# EAGLE design commadorable64-touch-v1-43 (EAGLE 6.5.0)
CNAME: An adorable Commodore 64; CREVISION: 1; DESIGNER: Johan Kanflo
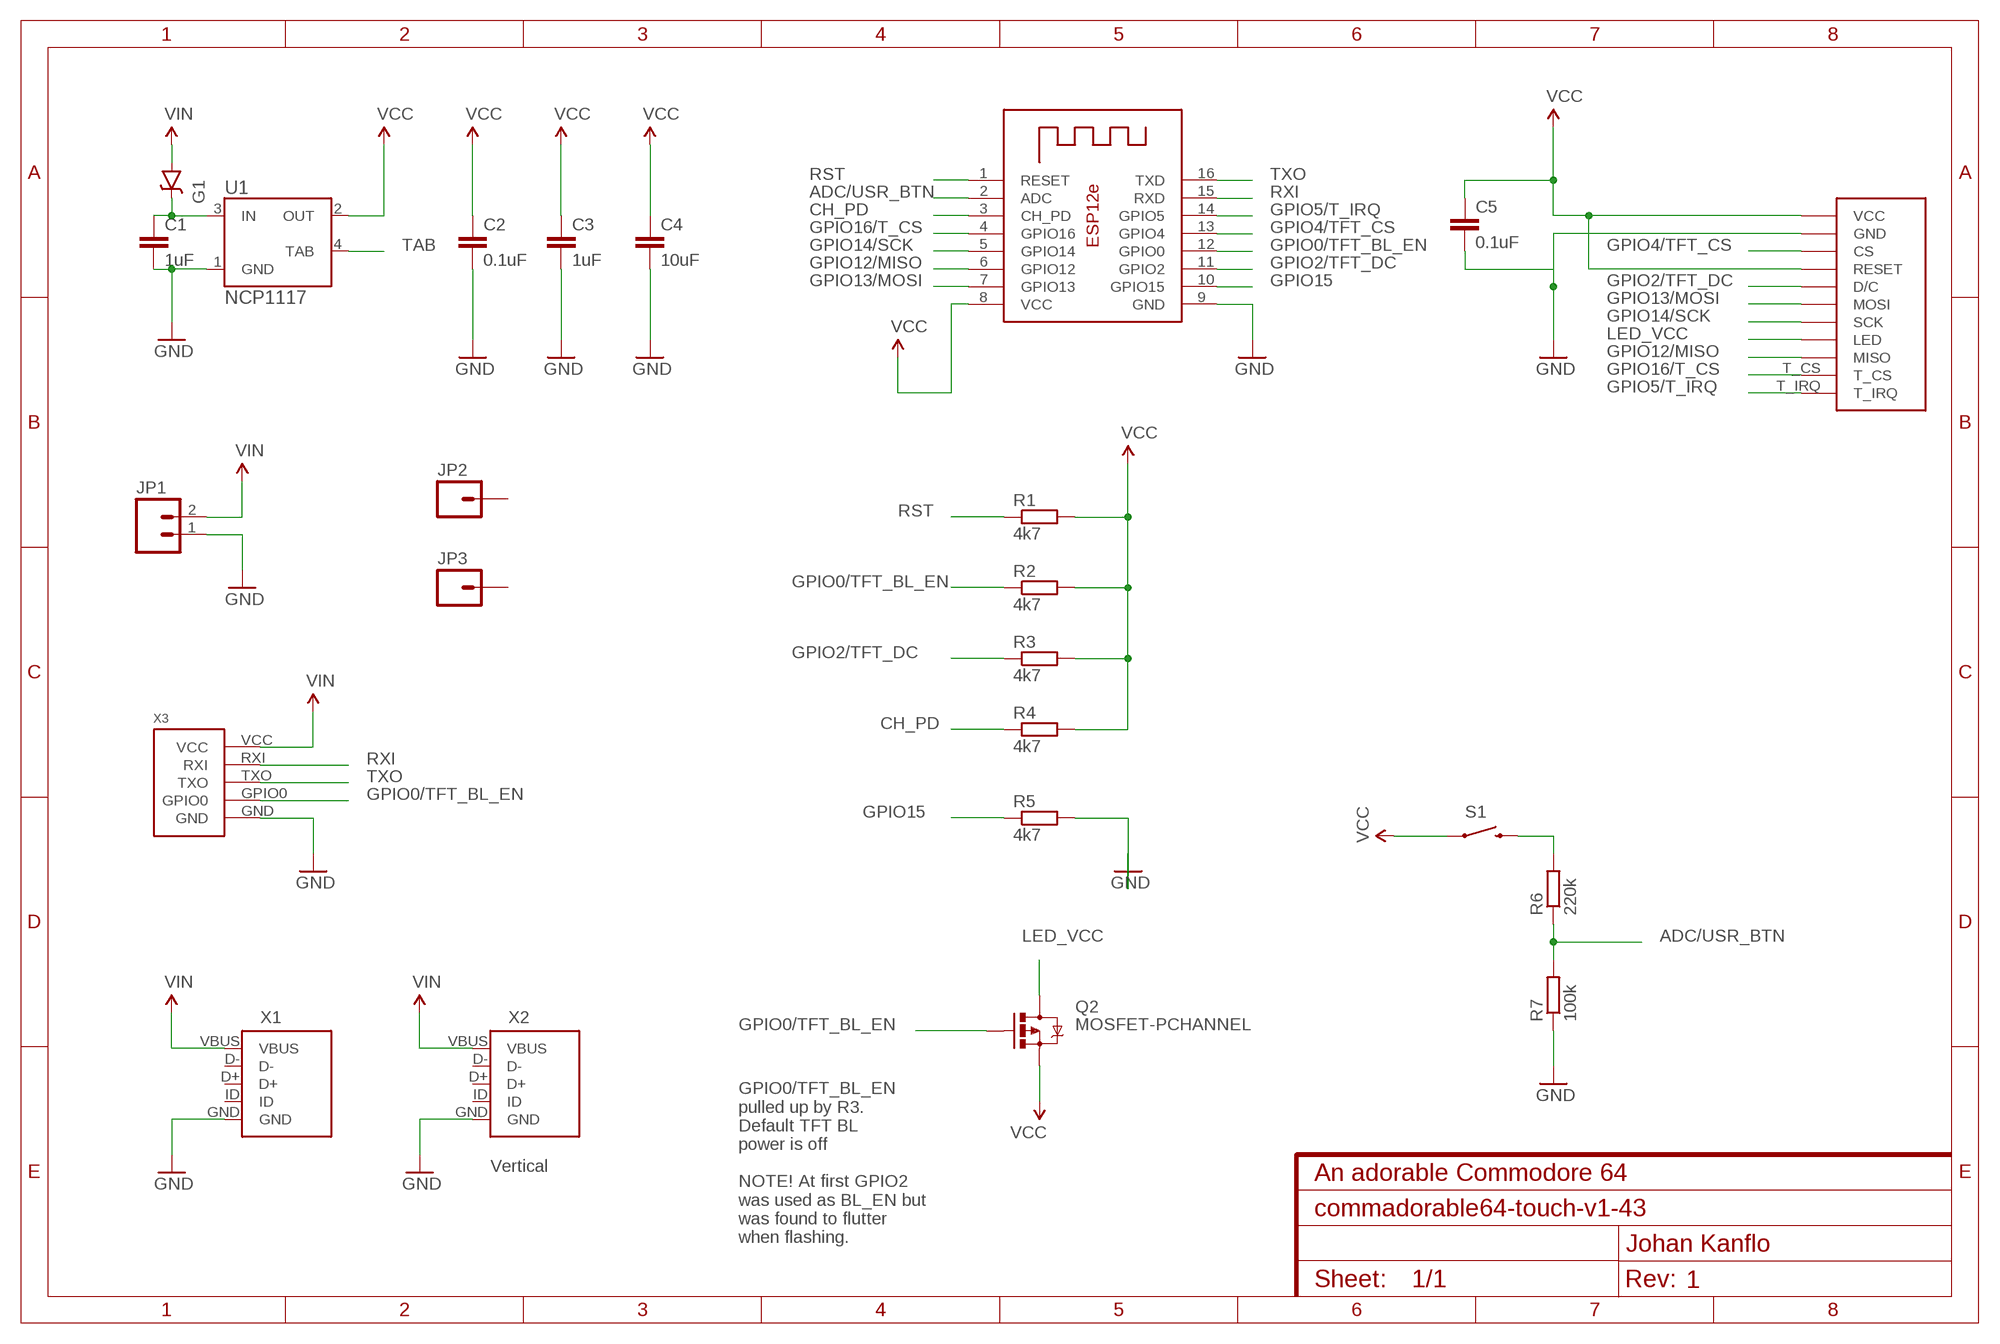
[diagram p0: schematic, sheet 1]

## Parts
C1  1uF  CAP0603-CAP  [0603-CAP]
C2  0.1uF  CAP0603-CAP  [0603-CAP]
C3  1uF  CAP0603-CAP  [0603-CAP]
C4  10uF  CAP0603-CAP  [0603-CAP]
C5  0.1uF  CAP0603-CAP  [0603-CAP]
G1  DIODE-SCHOTTKYSOD-123FL  [SOD-123FL]
J1  SPI_TFT_DISPLAY_TOUCH  [SPI_DISPLAY_TOUCH]
JP1  M02PTH  [1X02]
JP2  M01PTH  [1X01]
JP3  M01PTH  [1X01]
Q2  MOSFET-PCHANNEL  [SOT23-3]
R1  4k7  R-EU_R0603  [R0603]
R2  4k7  R-EU_R0603  [R0603]
R3  4k7  R-EU_R0603  [R0603]
R4  4k7  R-EU_R0603  [R0603]
R5  4k7  R-EU_R0603  [R0603]
R6  220k  R-EU_R0603  [R0603]
R7  100k  R-EU_R0603  [R0603]
S1  SWITCH-MOMENTARY-2SMD-1101NE  [TACTILE-SWITCH-1101NE]
U1  NCP1117  [SOT223]
U2  ESP-12E  [ESP-12E]
X1  MICRO_USB_TH  [MICRO_USB_TH]
X2  MICRO_USB_TH_VERTICAL  [MICRO_USB_TH_VERTICAL]
X3  ESPROGESPROG-DEVICE  [ESPROG]

## Nets
ADC/USR_BTN: R6.1 R7.2 U2.2(ADC)
CH_PD: R4.1 U2.3(CH_PD)
GND: C1.2 C2.2 C3.2 C4.2 C5.2 J1.GND JP1.1 R5.2 R7.1 U1.1(GND) U2.9(GND) X1.GND X2.GND X3.GND
GPIO0/TFT_BL_EN: Q2.1(G) R2.1 U2.12(GPIO0) X3.GPIO0
GPIO2/TFT_DC: J1.D/C R3.1 U2.11(GPIO2)
GPIO4/TFT_CS: J1.CS U2.13(GPIO4)
GPIO5/T_IRQ: J1.T_IRQ U2.14(GPIO5)
GPIO12/MISO: J1.MISO J1.T_MISO(MISO) U2.6(GPIO12)
GPIO13/MOSI: J1.MOSI J1.T_MOSI(MOSI) U2.7(GPIO13)
GPIO14/SCK: J1.SCK J1.T_SCK(SCK) U2.5(GPIO14)
GPIO15: R5.1 U2.10(GPIO15)
GPIO16/T_CS: J1.T_CS U2.4(GPIO16)
LED_VCC: J1.LED Q2.3(D)
N$1: C1.1 G1.C U1.3(IN)
N$4: R6.2 S1.2
RST: R1.1 U2.1(RESET)
RXI: U2.15(RXD) X3.RXI
TAB: U1.4(TAB)
TXO: U2.16(TXD) X3.TXO
VCC: C2.1 C3.1 C4.1 C5.1 J1.RESET J1.VCC Q2.2(S) R1.2 R2.2 R3.2 R4.2 S1.1 U1.2(OUT) U2.8(VCC)
VIN: G1.A JP1.2 X1.VBUS X2.VBUS X3.VCC
Unconnected: JP2.1 JP3.1 X1.D+ X1.D- X1.ID X2.D+ X2.D- X2.ID

## Notes on the sheet
- Vertical
- GPIO0/TFT_BL_EN
  pulled up by R3.
  Default TFT BL
  power is off
  
  NOTE! At first GPIO2
  was used as BL_EN but
  was found to flutter
  when flashing.

## Library data of the parts
C1-C5 = SparkFun-Capacitors:CAP: Capacitor Standard 0603 ceramic capacitor, and 0.1" leaded capacitor.
G1 = kanflo:DIODE-SCHOTTKY
J1 = kanflo:SPI_TFT_DISPLAY_TOUCH: SPI TFT Display with touch Connector for the cheap 2.4"/2.8" Serial SPI TFT displays with touch found on eBay.
JP1 = SparkFun-Connectors:M02: Standard 2-pin 0.1" header. Use with - straight break away headers ( PRT-00116) - right angle break away headers (PRT-00553) - swiss pins (PRT-00743) - machine pins (PRT-00117) - female headers (PRT-00115) Molex polarized connector foot print use with: PRT-08233 with associated crimp pins and housings. 2.54_SCREWTERM for use with PRT-10571. 3.5mm Screw Terminal footprints for PRT-08084 5mm Screw Terminal footprints for use with PRT-08432
JP2 JP3 = SparkFun-Connectors:M01: Header 1 Standard 1-pin 0.1" header. Use with straight break away headers (SKU : PRT-00116), right angle break away headers (PRT-00553), swiss pins (PRT-00743), machine pins (PRT-00117), and female headers (PRT-00115).
Q2 = SparkFun-DiscreteSemi:MOSFET-PCHANNEL: Generic PMOSFET IRLML2244 - TRANS-11153 (SOT-23 -20V -4.3A) (1.Gate 2.Source 3.Drain) FQP27P06 - COM-10349 <http://www.sparkfun.com/products/10349> (TO-220 -60V -27A) (1.Gate 2.Source 3.Drain); PROD_ID: TRANS-08285
R1-R7 = resistor:R-EU_: RESISTOR, European symbol
S1 = SparkFun-Electromechanical:SWITCH-MOMENTARY-2: Various NO switches- pushbuttons, reed, etc; PROD_ID: SWCH-00815
U1 = ELL-i-PowerIC:NCP1117
U2 = kanflo:ESP-12E: ESP12e module This is a copy of AdaFruit's device with correct pin order for GPIO4 and GPIO5.
X1 = kanflo:MICRO_USB_TH: Micro USB through hole connector A low cost micro USB connector from eBay, found here <http://www.ebay.com/itm/171309997171>.
X2 = kanflo:MICRO_USB_TH_VERTICAL: Vertical micro USB through hole connector A low cost vertical micro USB connector from eBay, found here <http://www.ebay.com/itm/181392933768>.
X3 = kanflo:ESPROG

## Board
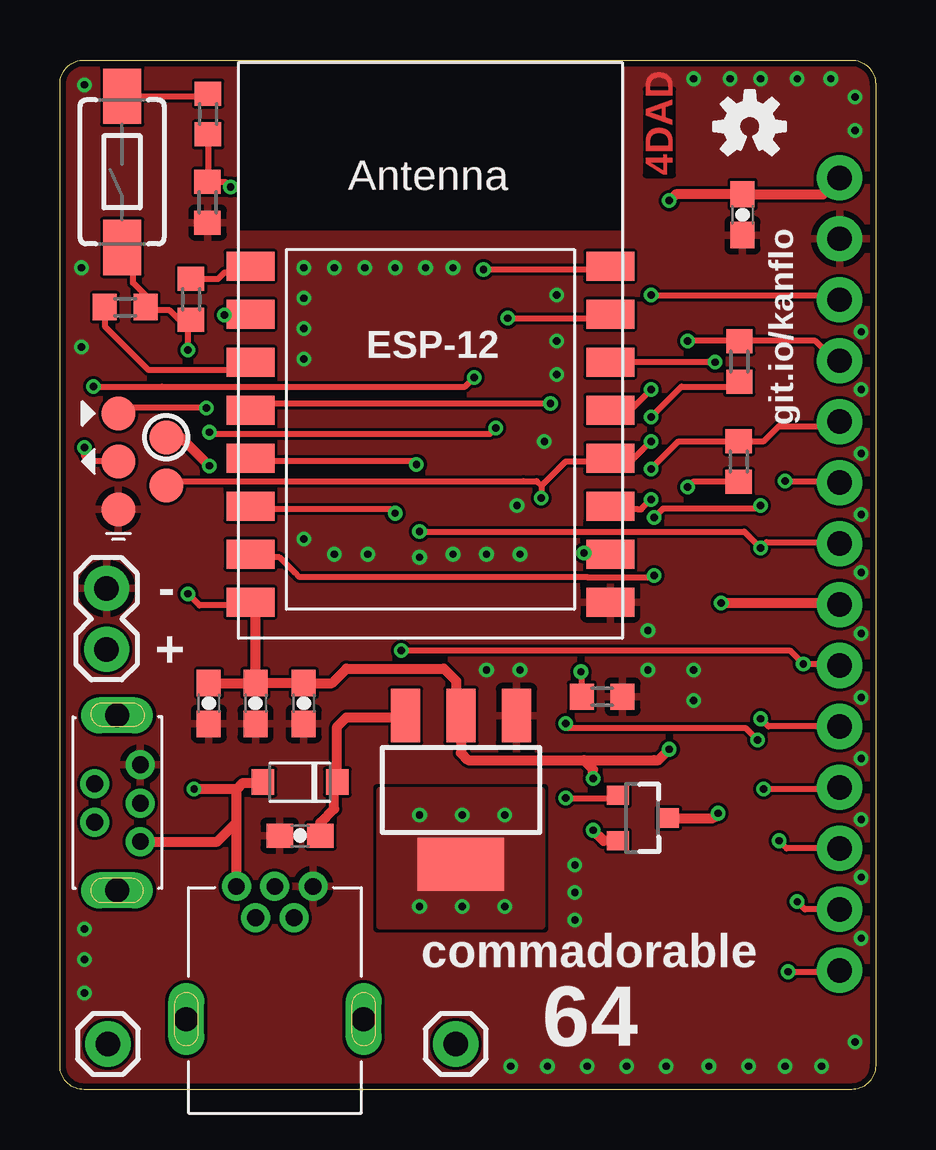
[diagram p1: board, top side]
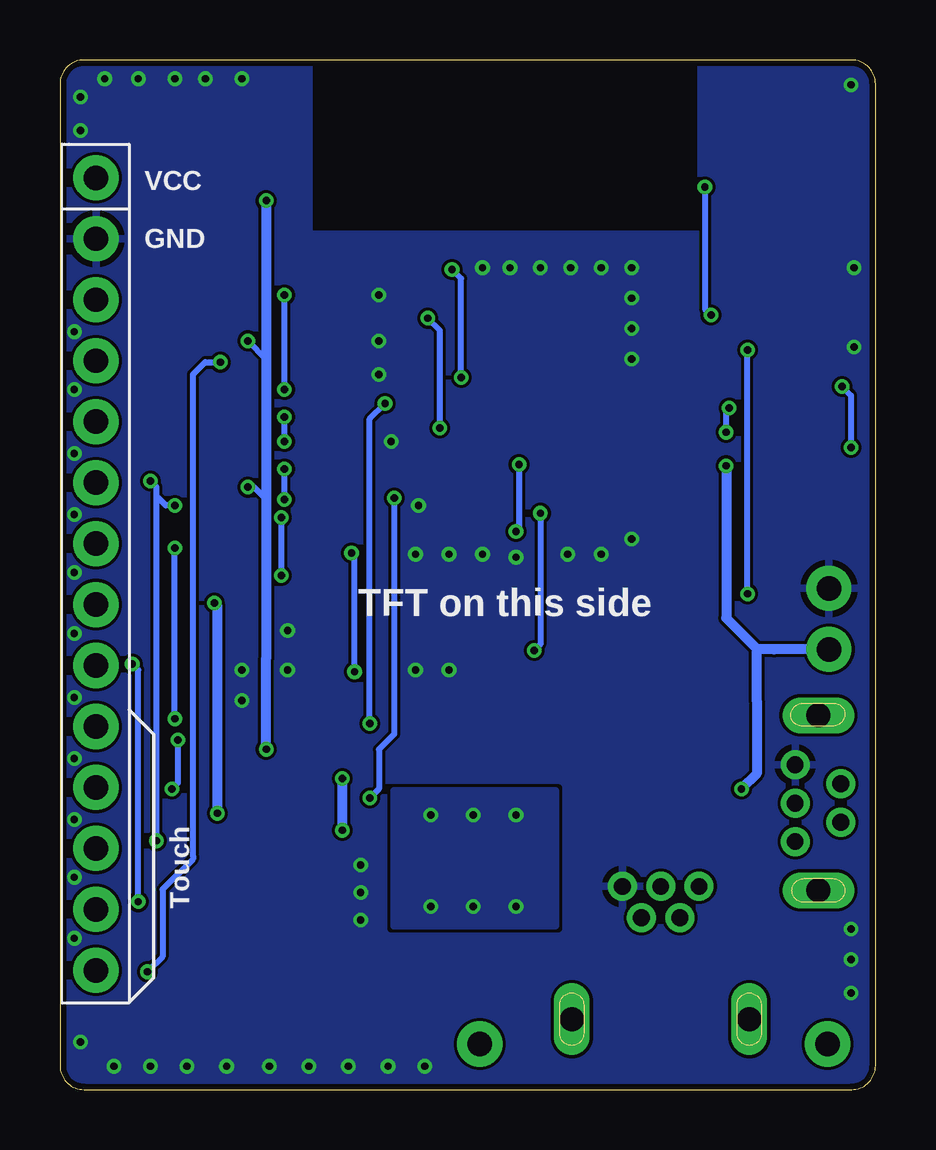
[diagram p2: board, bottom side, seen from below]

Size 34 x 42.9 mm. Coordinates in mm from the lower left corner, seen from the top.
Outline: 34,41.9 34,1 arc-90 33,0 1,0 arc-90 0,1 0,41.9 arc-90 1,42.9 33,42.9 arc-90 34,41.9
Copper layers (1*16): Top 0.035mm / dielectric 1.5mm / Bottom 0.035mm
Design rules "dirt_cheap_dirty_boards.v1": minimum track width 5mil, minimum drill 12mil, track to track 5mil, track to pad 5mil, pad to pad 5mil, via to via 5mil, smd to smd 0mil, copper to edge 10mil, drill to drill 10mil, minimum pad ring 10mil, minimum via ring 6mil, stop-mask expansion 2mil, vias tented up to drill 25mil, thermal gap 10mil

### Footprints (pad centres in the part's own frame; a part is rotated, then mirrored left to right if it is on the bottom)
0603-CAP = smd 1.1 x 1: 1 -0.85,0; 2 0.85,0
SOD-123FL = smd 0.95 x 1.05: A -1.6,0; C 1.5,0
SPI_DISPLAY_TOUCH = drill 1.016 pad 1.88: CS 0,7.62; D/C 0,2.54; GND 0,10.16; LED 0,-5.08; MISO 0,-7.62; MOSI 0,0; RESET 0,5.08; SCK 0,-2.54; T_CS 0,-12.7; T_IRQ 0,-20.32; T_MISO 0,-17.78; T_MOSI 0,-15.24; T_SCK 0,-10.16; VCC 0,12.7
1X02 = drill 1.016 pad 1.88: 1 0,0; 2 2.54,0
1X01 = drill 1.016 pad 1.88: 1 0,0
SOT23-3 = smd 0.8 x 0.9: 1 -0.95,-1; 2 0.95,-1; 3 0,1.1
R0603 = smd 1 x 1.1: 1 -0.85,0; 2 0.85,0
TACTILE-SWITCH-1101NE = smd 2.3 x 1.6: 1 -3.15,0; 2 3.15,0
SOT223 = smd 1.219 x 2.235: 1 -2.311,-3.099; 2 0,-3.099; 3 2.311,-3.099 | smd 3.6 x 2.2: 4 0,3.099
ESP-12E = smd 2 x 1.2: 1 -7.5,4.5; 2 -7.5,2.5; 3 -7.5,0.5; 4 -7.5,-1.5; 5 -7.5,-3.5; 6 -7.5,-5.5; 7 -7.5,-7.5; 8 -7.5,-9.5; 9 7.5,-9.5; 10 7.5,-7.5; 11 7.5,-5.5; 12 7.5,-3.5; 13 7.5,-1.5; 14 7.5,0.5; 15 7.5,2.5; 16 7.5,4.5
MICRO_USB_TH = drill 0.7: D+ -0.11,4.73; D- -0.91,3.43; GND 1.49,4.73; ID 0.69,3.43; VBUS -1.71,4.73 | drill 1 pad 1.5 long: P$1 -3.8,-0.8; P$2 3.6,-0.8
MICRO_USB_TH_VERTICAL = drill 0.7: D+ -0.16,-1.27; D- -0.96,0.63; GND 1.44,-1.27; ID 0.65,0.63; VBUS -1.76,-1.27 | drill 1 pad 1.5 long: P$1 -3.8,-0.3; P$2 3.5,-0.3
ESPROG = smd 1.422 x 1.422: GND -1,-2; GPIO0 1,-1; RXI -1,2; TXO -1,0; VCC 1,1

### Placement (x,y rotation side)
C1  10.01,10.58 180 top
C2  6.2,16.09 270 top
C3  8.16,16.09 270 top
C4  10.16,16.09 270 top
C5  28.45,36.46 270 top
G1  10.06,12.81 0 top
J1  32.5,25.29 0 bottom
JP1  1.94,20.88 270 top
JP2  2,1.9 0 top
JP3  16.5,1.9 0 top
Q2  24.26,11.31 270 top
R1  5.46,32.93 270 top
R2  28.32,30.33 90 top
R3  28.3,26.17 270 top
R4  2.72,32.6 0 top
R5  22.61,16.37 0 top
R6  6.17,40.65 90 top
R7  6.15,36.97 90 top
S1  2.59,38.24 90 top
U1  16.72,12.48 180 top
U2  15.45,29.81 0 top
U$1  [OSHW-LOGO-S]  28.76,40.13 0 top
X1  9.06,3.74 0 top
X2  2.08,12.1 90 top
X3  3.43,26.18 0 top

### Tracks (layer width: path | path; a pad name or v marks a point on that pad's centre or on a via)
ADC/USR_BTN  (via drill 0.3 pad 0.25)
  Top 0.254: R6.1 6.17,37.84 R7.2 6.9,37.82 v7.11,37.6 | v6.86,32.27 8.23,32.27 U2.2
  Bottom 0.254: v7.11,37.6 7.11,32.52 v6.86,32.27
CH_PD
  Top 0.254: R4.1 1.87,31.8 3.68,29.98 8.13,29.98 U2.3
GND  (via drill 0.3 pad 0.25)
  other vias: 33.4,31.58 33.4,29.17 33.4,26.5 33.4,23.96 33.4,21.55 33.4,19.01 33.4,16.34 33.4,13.8 33.4,11.26 33.4,8.85 33.4,6.31 19.18,17.48 17.78,17.48 24.51,17.48 26.42,17.48 26.42,16.21 21.47,9.35 21.47,8.21 21.47,7.07 18.8,0.97 20.32,0.97 21.97,0.97 23.62,0.97 25.27,0.97 27.05,0.97 28.7,0.97 30.23,0.97 31.75,0.97 33.15,1.99 1.02,6.69 1.02,5.42 1.02,4.02 10.16,34.25 11.43,34.25 12.7,34.25 13.97,34.25 15.24,34.25 16.38,34.25 10.16,32.98 10.16,31.71 10.16,30.44 10.16,22.94 19.18,22.31 19.05,24.34 20.2,27.01 20.7,29.8 20.7,31.2 20.7,33.1 11.43,22.31 12.83,22.31 14.99,22.18 16.38,22.31 17.78,22.31 24.51,19.13 33.15,39.96 33.15,41.36 32.13,42.12 30.74,42.12 29.21,42.12 27.94,42.12 26.42,42.12 0.89,34.25 0.89,30.94 1.02,41.87
  pour Top (rank 6): 0,42.9 34,42.9 34,0 0,0
  pour Bottom (rank 6): 0,42.9 34,42.9 34,0 0,0
GPIO0/TFT_BL_EN  (via drill 0.3 pad 0.25)
  Top 0.254: 23.32,26.17 U2.12 | 28.13,29.68 R2.1 28.13,29.29 25.91,29.29 25.27,28.66 v24.64,28.02 | 20.07,25.16 21.08,26.17 23.32,26.17 | 23.32,26.17 U2.12 | 20.07,25.16 v20.07,24.65 | 23.2,12.2 Q2.1 23.14,12.15 v21.08,12.15 | U2.12 23.81,26.18 v24.64,27.01 | X3.GPIO0 4.78,25.18 4.95,25.36 19.31,25.36 19.87,25.36 20.07,25.16
  Bottom 0.254: v20.07,24.65 20.07,14.87 20.07,14.81 20.7,14.18 20.7,12.53 v21.08,12.15 | v24.64,27.01 v24.64,28.02
GPIO2/TFT_DC  (via drill 0.3 pad 0.25)
  Top 0.254: R3.1 29.35,27.02 29.97,27.64 32.31,27.64 J1.D/C | 28.29,27.01 R3.1 | U2.11 23.07,24.18 24.1,24.18 24.23,24.18 v24.64,24.59 | v24.64,25.86 25.78,27.01 28.29,27.01 | 28.29,27.01 R3.1
  Bottom 0.254: v24.64,24.59 v24.64,25.86
GPIO4/TFT_CS  (via drill 0.3 pad 0.25)
  Top 0.254: U2.13 23.65,28.18 v24.64,29.17 | v24.64,33.1 32.31,33.1 J1.CS
  Bottom 0.254: v24.64,29.17 v24.64,33.1
GPIO5/T_IRQ  (via drill 0.3 pad 0.25)
  Top 0.254: 23.38,30.24 U2.14 23.46,30.31 v27.31,30.31 | v30.35,4.91 32.44,4.91 J1.T_IRQ
  Bottom 0.254: v27.31,30.31 27.94,30.31 28.45,29.8 28.45,29.67 28.45,9.74 28.45,9.61 29.72,8.34 29.72,5.54 v30.35,4.91
GPIO12/MISO  (via drill 0.3 pad 0.25)
  Top 0.254: J1.T_MISO 31.06,7.51 v30.74,7.83 | J1.MISO 32.43,17.74 v30.99,17.74 30.43,18.3 26.23,18.3 v14.23,18.3 | v13.97,24.01 13.81,24.18 8.07,24.18 U2.6
  Bottom 0.254: v30.74,7.83 30.74,17.48 v30.99,17.74 | v13.97,24.01 13.97,18.55 v14.23,18.3
GPIO13/MOSI  (via drill 0.3 pad 0.25)
  Top 0.254: J1.T_MOSI 30.29,10.05 v29.97,10.37 | v30.23,25.36 32.43,25.36 J1.MOSI | v24.77,21.42 24.7,21.35 24.64,21.35 21.97,21.35 9.98,21.35 9.78,21.55 9.15,22.18 8.07,22.18 U2.7 | v24.77,23.83 25.15,24.21 29.09,24.21 v29.21,24.34
  Bottom 0.254: v29.97,10.37 29.97,24.72 | 29.97,24.72 29.97,25.1 v30.23,25.36 | v29.21,24.34 29.59,24.34 29.97,24.72 | v24.77,21.42 v24.77,23.83
GPIO14/SCK  (via drill 0.3 pad 0.25)
  Top 0.254: J1.T_SCK 29.53,15.13 v29.21,15.45 | v29.21,22.56 29.47,22.82 32.43,22.82 J1.SCK | v14.86,26.05 14.73,26.18 8.07,26.18 U2.5 | 29.09,22.69 v29.21,22.56 | v29.21,22.56 28.65,23.13 28.52,23.25 v14.99,23.25
  Bottom 0.254: v29.21,15.45 v29.21,22.56 | v14.86,26.05 14.86,23.38 v14.99,23.25
GPIO15  (via drill 0.3 pad 0.25)
  Top 0.254: R5.1 21.76,17.37 v21.72,17.41 | v21.85,22.36 23.14,22.36 U2.10
  Bottom 0.254: v21.72,17.41 21.72,22.24 v21.85,22.36
GPIO16/T_CS  (via drill 0.3 pad 0.25)
  Top 0.254: v20.45,28.59 8.73,28.59 U2.4 | v21.08,15.25 21.08,15.2 21.21,15.07 28.58,15.07 v29.09,14.56 | v29.34,12.53 32.44,12.53 J1.T_CS
  Bottom 0.254: v21.08,15.25 21.08,27.95 v20.45,28.59 | v29.09,14.56 29.09,12.78 v29.34,12.53
LED_VCC  (via drill 0.3 pad 0.25)
  Top 0.406: v27.56,20.28 32.43,20.28 J1.LED | Q2.3 27.24,11.31 v27.43,11.51
  Bottom 0.406: v27.56,20.28 27.43,20.15 27.43,15.07 v27.43,11.51
N$1
  Top 0.406: U1.3 14.33,15.51 11.94,15.51 11.56,15.13 G1.C 11.43,12.69 11.43,11.7 10.86,11.12 C1.1
N$4
  Top 0.254: S1.2 6.06,41.39 R6.2
RST
  Top 0.254: R1.1 6.59,33.78 6.86,34.05 8.2,34.05 U2.1
RXI  (via drill 0.3 pad 0.25)
  Top 0.254: v18.16,27.57 17.91,27.32 6.48,27.32 6.3,27.32 v6.23,27.39 | v18.67,32.14 23.29,32.14 U2.15 | v6.1,28.4 2.66,28.4 X3.RXI
  Bottom 0.254: v18.16,27.57 18.16,31.63 v18.67,32.14 | v6.23,27.39 6.23,28.28 v6.1,28.4
TAB  (via drill 0.3 pad 0.25)
  other vias: 14.99,7.63 16.77,7.63 18.54,7.63 14.99,11.44 16.77,11.44 18.54,11.44
  pour Top (no thermals): 13.34,12.46 20.07,12.46 20.07,6.82 13.34,6.82
  pour Bottom: 13.34,12.46 20.07,12.46 20.07,6.82 13.34,6.82
TXO  (via drill 0.3 pad 0.25)
  Top 0.254: v17.66,34.17 23.32,34.17 U2.16 | X3.TXO 1.21,26.18 1.02,26.37 v1.02,26.75 | v1.4,29.29 4.25,29.29 16.89,29.29 v17.27,29.67
  Bottom 0.254: v17.66,34.17 17.27,33.79 v17.27,29.67 | v1.02,26.75 1.02,28.91 v1.4,29.29
VCC  (via drill 0.3 pad 0.25)
  Top 0.254: J1.RESET 32.33,30.37 31.5,31.2 28.34,31.2 | 28.34,31.2 R2.2 | 28.34,31.2 26.42,31.2 v26.16,31.2 | R3.2 26.38,25.32 v26.16,25.1 | 7.82,20.18 5.81,20.18 v5.34,20.66 | v5.34,30.82 5.34,31.95 | 5.34,31.95 R1.2 | 5.34,31.95 5.09,31.95 4.57,32.47 3.7,32.47 R4.2 3.57,33.09 3.05,33.61 3.05,34.5 3.05,34.63 S1.1
  Top 0.406: C3.1 8.16,20.01 U2.8 7.82,20.18 | C3.1 C4.1 11.34,16.94 11.94,17.54 16,17.54 16.51,17.03 16.51,15.79 U1.2 16.72,14.03 17.02,13.73 21.85,13.73 | C2.1 C3.1 | 21.85,13.73 24.77,13.73 24.95,13.73 v25.4,14.18 | 5.34,31.95 R1.2 | J1.VCC 31.82,37.31 C5.1 25.67,37.31 v25.4,37.04 | Q2.2 22.67,10.37 v22.23,10.81 | v22.23,12.97 22.23,13.35 21.85,13.73
  Bottom 0.254: v26.16,31.2 25.4,30.44 | v26.16,25.1 25.91,25.1 25.4,24.59 | v5.34,20.66 v5.34,30.82
  Bottom 0.406: v25.4,37.04 25.4,30.44 25.4,24.59 25.4,17.99 v25.4,14.18 | v22.23,10.81 v22.23,12.97
VIN  (via drill 0.3 pad 0.25)
  Top 0.406: X1.VBUS 7.36,11.13 | 7.36,11.13 7.36,12.52 | 7.36,12.52 7.62,12.78 8.43,12.78 G1.A | X2.VBUS 6.56,10.34 7.36,11.13 | v5.59,12.53 7.34,12.53 7.36,12.52 | X3.VCC 5.04,27.18 v6.23,25.99
  Bottom 0.406: v5.59,12.53 4.95,13.16 4.95,16.21 4.95,18.21 4.83,18.34 | JP1.2 4.22,18.34 4.83,18.34 | v6.23,25.99 6.23,19.64 5.08,18.5 4.93,18.34 4.83,18.34

### Text on the board
Top: 4DAD
tNames: ESP-12 | git.io/kanflo | - | + | commadorable | 64
bNames: VCC | GND | TFT on this side | Touch